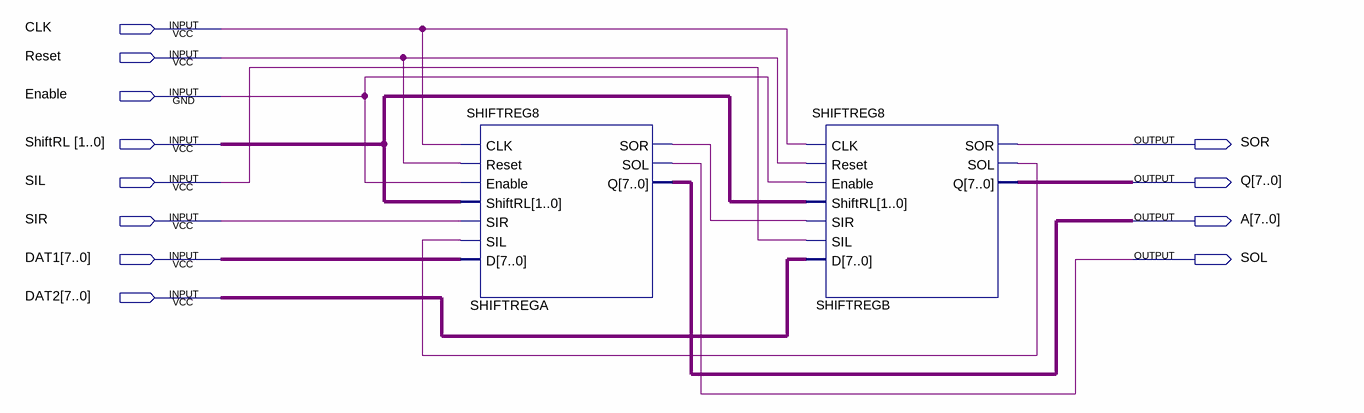
[diagram p0: schematic sheet]
// Quartus schematic SHIFTREGS.bdf as structural Verilog: 2 symbols, 12 pins
module SHIFTREGS (
  input  CLK,
  input  Reset,
  input  Enable,
  input  [1:0] ShiftRL,
  input  SIL,
  input  SIR,
  input  [7:0] DAT1,
  input  [7:0] DAT2,
  output SOR,
  output [7:0] Q,
  output [7:0] A,
  output SOL
);

  wire SHIFTREGA_sor, SHIFTREGB_sol;

  SHIFTREG8 SHIFTREGA (
    .CLK(CLK), .Reset(Reset), .Enable(Enable), .ShiftRL(ShiftRL), .SIR(SIR), .SIL(SHIFTREGB_sol), .D(DAT1),
    .SOR(SHIFTREGA_sor), .SOL(SOL), .Q(A));
  SHIFTREG8 SHIFTREGB (
    .CLK(CLK), .Reset(Reset), .Enable(Enable), .ShiftRL(ShiftRL), .SIR(SHIFTREGA_sor), .SIL(SIL), .D(DAT2),
    .SOR(SOR), .SOL(SHIFTREGB_sol), .Q(Q));
endmodule
